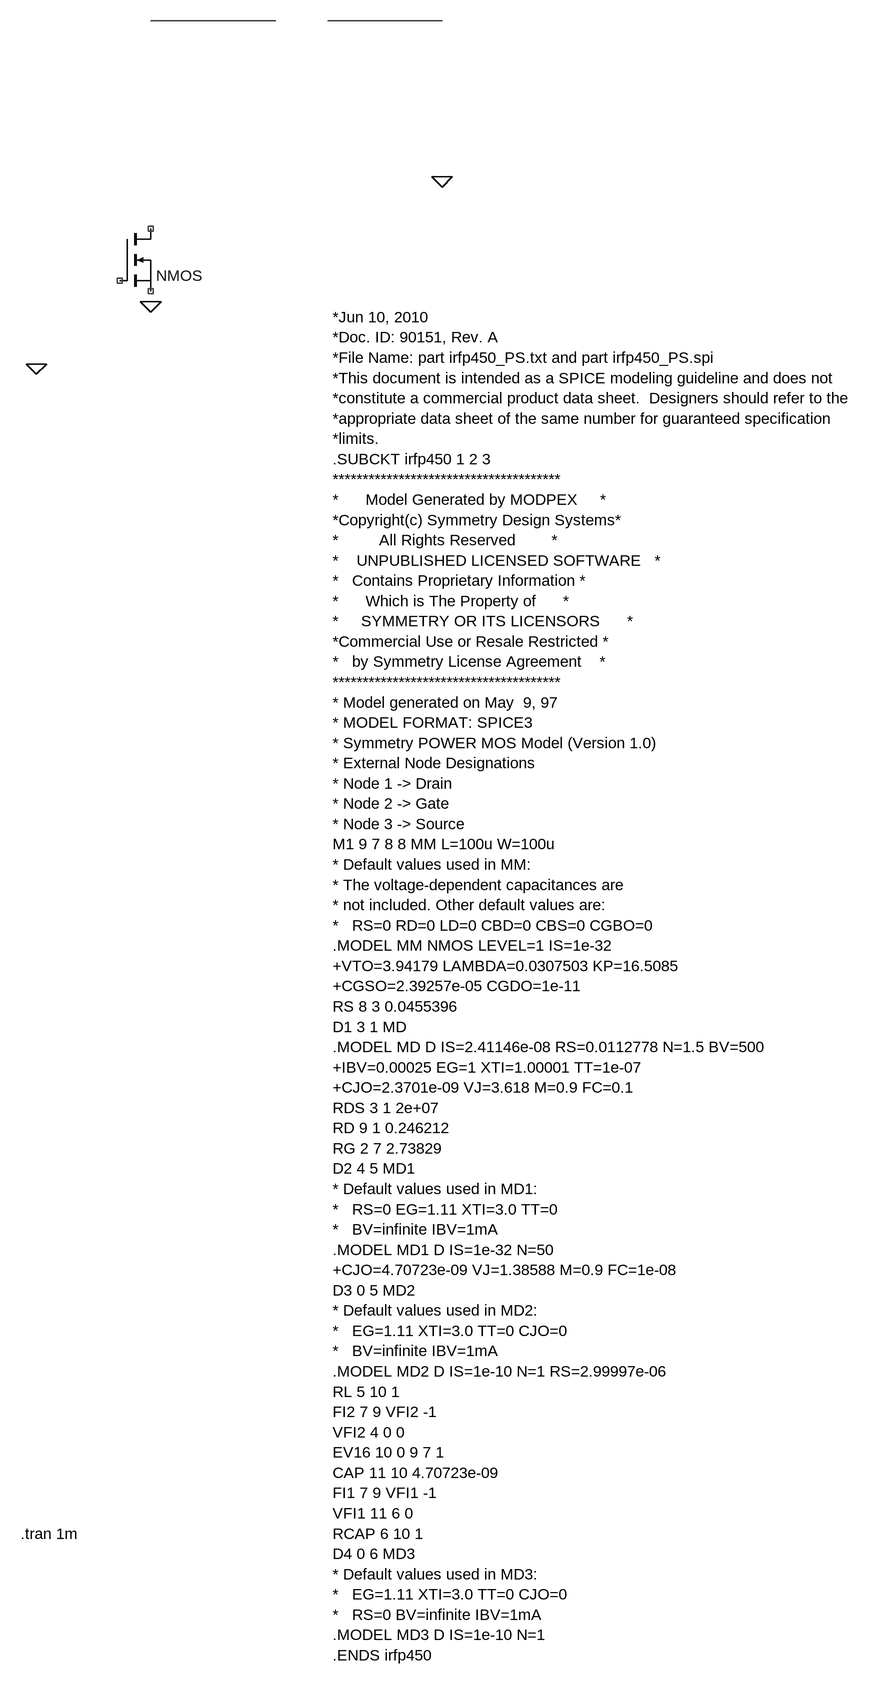
[diagram p0: schematic test1.asc]
test1.asc, the LTspice schematic file:
Version 4
SHEET 1 1444 2152
WIRE 384 -192 192 -192
WIRE 640 -192 464 -192
FLAG 192 240 0
FLAG 640 48 0
FLAG 16 336 0
SYMBOL nmos 144 128 R0
TEXT 472 264 Left 2 !*Jun 10, 2010\n*Doc. ID: 90151, Rev. A\n*File Name: part irfp450_PS.txt and part irfp450_PS.spi\n*This document is intended as a SPICE modeling guideline and does not\n*constitute a commercial product data sheet.  Designers should refer to the\n*appropriate data sheet of the same number for guaranteed specification\n*limits.\n.SUBCKT irfp450 1 2 3\n**************************************\n*      Model Generated by MODPEX     *\n*Copyright(c) Symmetry Design Systems*\n*         All Rights Reserved        *\n*    UNPUBLISHED LICENSED SOFTWARE   *\n*   Contains Proprietary Information *\n*      Which is The Property of      *\n*     SYMMETRY OR ITS LICENSORS      *\n*Commercial Use or Resale Restricted *\n*   by Symmetry License Agreement    *\n**************************************\n* Model generated on May  9, 97\n* MODEL FORMAT: SPICE3\n* Symmetry POWER MOS Model (Version 1.0)\n* External Node Designations\n* Node 1 -> Drain\n* Node 2 -> Gate\n* Node 3 -> Source\nM1 9 7 8 8 MM L=100u W=100u\n* Default values used in MM:\n* The voltage-dependent capacitances are\n* not included. Other default values are:\n*   RS=0 RD=0 LD=0 CBD=0 CBS=0 CGBO=0\n.MODEL MM NMOS LEVEL=1 IS=1e-32\n+VTO=3.94179 LAMBDA=0.0307503 KP=16.5085\n+CGSO=2.39257e-05 CGDO=1e-11\nRS 8 3 0.0455396\nD1 3 1 MD\n.MODEL MD D IS=2.41146e-08 RS=0.0112778 N=1.5 BV=500\n+IBV=0.00025 EG=1 XTI=1.00001 TT=1e-07\n+CJO=2.3701e-09 VJ=3.618 M=0.9 FC=0.1\nRDS 3 1 2e+07\nRD 9 1 0.246212\nRG 2 7 2.73829\nD2 4 5 MD1\n* Default values used in MD1:\n*   RS=0 EG=1.11 XTI=3.0 TT=0\n*   BV=infinite IBV=1mA\n.MODEL MD1 D IS=1e-32 N=50\n+CJO=4.70723e-09 VJ=1.38588 M=0.9 FC=1e-08\nD3 0 5 MD2\n* Default values used in MD2:\n*   EG=1.11 XTI=3.0 TT=0 CJO=0\n*   BV=infinite IBV=1mA\n.MODEL MD2 D IS=1e-10 N=1 RS=2.99997e-06\nRL 5 10 1\nFI2 7 9 VFI2 -1\nVFI2 4 0 0\nEV16 10 0 9 7 1\nCAP 11 10 4.70723e-09\nFI1 7 9 VFI1 -1\nVFI1 11 6 0\nRCAP 6 10 1\nD4 0 6 MD3\n* Default values used in MD3:\n*   EG=1.11 XTI=3.0 TT=0 CJO=0\n*   RS=0 BV=infinite IBV=1mA\n.MODEL MD3 D IS=1e-10 N=1\n.ENDS irfp450
TEXT -8 2136 Left 2 !.tran 1m

The netlist it stands for:
* test1.asc
M§? NC_01 NC_02 NC_03 NC_03 NMOS
.model NMOS NMOS
.model PMOS PMOS
.lib standard.mos
*Jun 10, 2010
*Doc. ID: 90151, Rev. A
*File Name: part irfp450_PS.txt and part irfp450_PS.spi
*This document is intended as a SPICE modeling guideline and does not
*constitute a commercial product data sheet.  Designers should refer to the
*appropriate data sheet of the same number for guaranteed specification
*limits.
.SUBCKT irfp450 1 2 3
**************************************
*      Model Generated by MODPEX     *
*Copyright(c) Symmetry Design Systems*
*         All Rights Reserved        *
*    UNPUBLISHED LICENSED SOFTWARE   *
*   Contains Proprietary Information *
*      Which is The Property of      *
*     SYMMETRY OR ITS LICENSORS      *
*Commercial Use or Resale Restricted *
*   by Symmetry License Agreement    *
**************************************
* Model generated on May  9, 97
* MODEL FORMAT: SPICE3
* Symmetry POWER MOS Model (Version 1.0)
* External Node Designations
* Node 1 -> Drain
* Node 2 -> Gate
* Node 3 -> Source
M1 9 7 8 8 MM L=100u W=100u
* Default values used in MM:
* The voltage-dependent capacitances are
* not included. Other default values are:
*   RS=0 RD=0 LD=0 CBD=0 CBS=0 CGBO=0
.MODEL MM NMOS LEVEL=1 IS=1e-32
+VTO=3.94179 LAMBDA=0.0307503 KP=16.5085
+CGSO=2.39257e-05 CGDO=1e-11
RS 8 3 0.0455396
D1 3 1 MD
.MODEL MD D IS=2.41146e-08 RS=0.0112778 N=1.5 BV=500
+IBV=0.00025 EG=1 XTI=1.00001 TT=1e-07
+CJO=2.3701e-09 VJ=3.618 M=0.9 FC=0.1
RDS 3 1 2e+07
RD 9 1 0.246212
RG 2 7 2.73829
D2 4 5 MD1
* Default values used in MD1:
*   RS=0 EG=1.11 XTI=3.0 TT=0
*   BV=infinite IBV=1mA
.MODEL MD1 D IS=1e-32 N=50
+CJO=4.70723e-09 VJ=1.38588 M=0.9 FC=1e-08
D3 0 5 MD2
* Default values used in MD2:
*   EG=1.11 XTI=3.0 TT=0 CJO=0
*   BV=infinite IBV=1mA
.MODEL MD2 D IS=1e-10 N=1 RS=2.99997e-06
RL 5 10 1
FI2 7 9 VFI2 -1
VFI2 4 0 0
EV16 10 0 9 7 1
CAP 11 10 4.70723e-09
FI1 7 9 VFI1 -1
VFI1 11 6 0
RCAP 6 10 1
D4 0 6 MD3
* Default values used in MD3:
*   EG=1.11 XTI=3.0 TT=0 CJO=0
*   RS=0 BV=infinite IBV=1mA
.MODEL MD3 D IS=1e-10 N=1
.ENDS irfp450
.tran 1m
.backanno
.end